# EAGLE design SmartPlug (EAGLE 6.4)
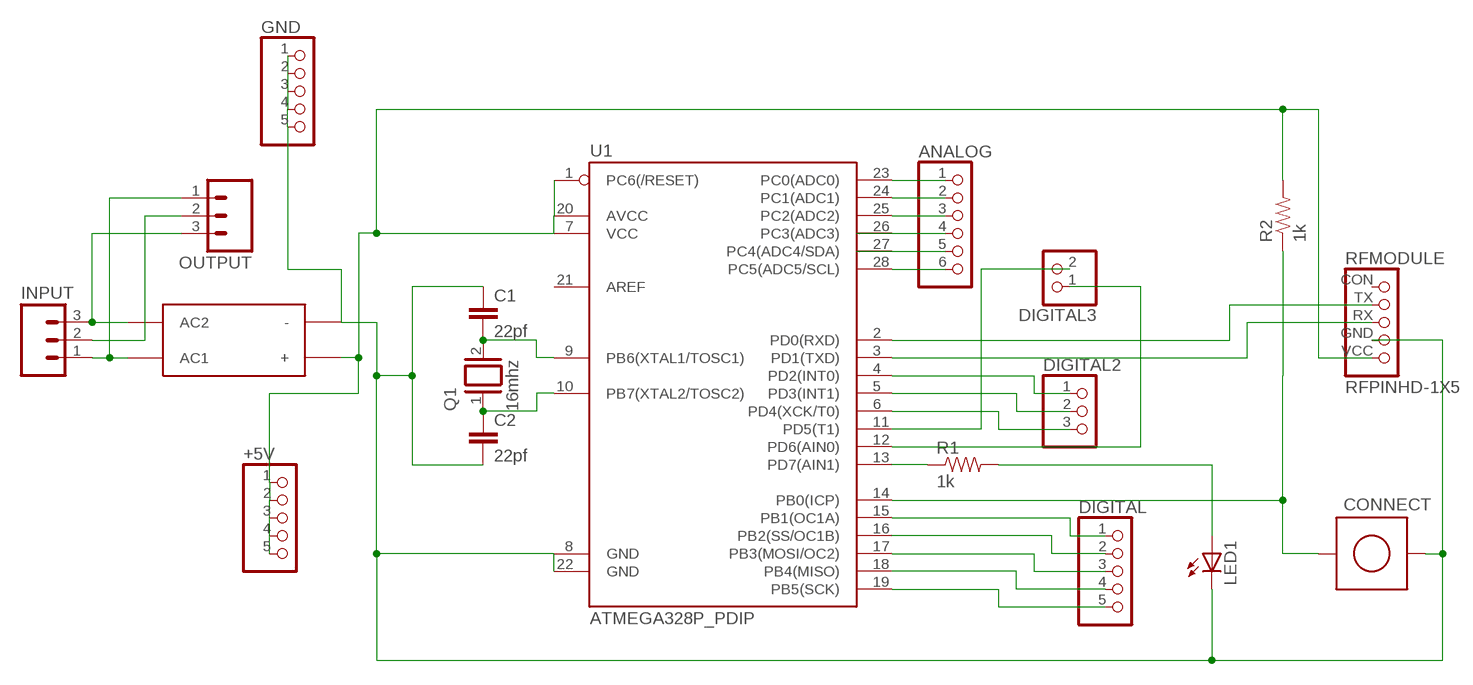
[diagram p0: schematic, sheet 1]

## Parts
+5V  PINHD-1X5  [1X05]
ANALOG  PINHD-1X6  [1X06]
C1  22pf  CAPPTH1  [CAP-PTH-5MM]
C2  22pf  CAPPTH1  [CAP-PTH-5MM]
CONNECT  PUSHBUTTON6MM  [PUSHBUTTON6MM]
DIGITAL  PINHD-1X5  [1X05]
DIGITAL2  PINHD-1X3  [1X03]
DIGITAL3  PINHD-1X2  [1X02]
GND  PINHD-1X5  [1X05]
INPUT  M03-SCREW-5MM  [SCREWTERMINAL-5MM-3]
LED1  LED3MM  [LED3MM]
OUTPUT  M03-SCREW-5MM  [SCREWTERMINAL-5MM-3]
POWERMODULE  POWER_MODULE  [POWER_MODULE]
Q1  16mhz  XTAL/S  [QS]
R1  1k  RESISTORPTH-1/6W  [1/6W-RES]
R2  1k  RESISTORPTH-1/6W  [1/6W-RES]
RFMODULE  RFPINHD-1X5  [1X05]
U1  ATMEGA328P_PDIP  [DIL28-3]

## Nets
N$1: RFMODULE.TX U1.2(PD0(RXD))
N$2: RFMODULE.RX U1.3(PD1(TXD))
N$3: LED1.A R1.2
N$4: +5V.1 +5V.2 +5V.3 +5V.4 +5V.5 POWERMODULE.+ R2.2 RFMODULE.VCC U1.1(PC6(/RESET)) U1.7(VCC) U1.20(AVCC)
N$5: C1.2 Q1.2 U1.9(PB6(XTAL1/TOSC1))
N$6: C2.1 Q1.1 U1.10(PB7(XTAL2/TOSC2))
N$7: CONNECT.P$1 R2.1 U1.14(PB0(ICP))
N$8: ANALOG.1 U1.23(PC0(ADC0))
N$9: ANALOG.5 U1.27(PC4(ADC4/SDA))
N$10: DIGITAL3.2 U1.11(PD5(T1))
N$11: R1.1 U1.13(PD7(AIN1))
N$12: ANALOG.2 U1.24(PC1(ADC1))
N$13: ANALOG.3 U1.25(PC2(ADC2))
N$14: ANALOG.6 U1.28(PC5(ADC5/SCL))
N$15: DIGITAL.1 U1.15(PB1(OC1A))
N$16: DIGITAL.2 U1.16(PB2(SS/OC1B))
N$17: DIGITAL.3 U1.17(PB3(MOSI/OC2))
N$18: DIGITAL.4 U1.18(PB4(MISO))
N$19: DIGITAL.5 U1.19(PB5(SCK))
N$20: INPUT.3 OUTPUT.3 POWERMODULE.AC2
N$21: INPUT.2 OUTPUT.2
N$22: INPUT.1 OUTPUT.1 POWERMODULE.AC1
N$23: DIGITAL2.1 U1.4(PD2(INT0))
N$24: DIGITAL2.2 U1.5(PD3(INT1))
N$25: DIGITAL2.3 U1.6(PD4(XCK/T0))
N$26: DIGITAL3.1 U1.12(PD6(AIN0))
N$27: ANALOG.4 U1.26(PC3(ADC3))
N$28: C1.1 C2.2 CONNECT.P$2 GND.1 GND.2 GND.3 GND.4 GND.5 LED1.K(C) POWERMODULE.- RFMODULE.GND U1.8(GND) U1.22(GND)
Unconnected: RFMODULE.CON U1.21(AREF)

## Library data of the parts
+5V DIGITAL GND = pinhead:PINHD-1X5: PIN HEADER
ANALOG = pinhead:PINHD-1X6: PIN HEADER
C1 C2 = SparkFun-Passives:CAP: Capacitor Standard 0603 ceramic capacitor, and 0.1" leaded capacitor.
CONNECT = jalf:PUSHBUTTON6MM
DIGITAL2 = pinhead:PINHD-1X3: PIN HEADER
DIGITAL3 = pinhead:PINHD-1X2: PIN HEADER
INPUT OUTPUT = SparkFun-Connectors:M03: Header 3 Standard 3-pin 0.1" header. Use with straight break away headers (SKU : PRT-00116), right angle break away headers (PRT-00553), swiss pins (PRT-00743), machine pins (PRT-00117), and female headers (PRT-00115). Molex polarized connector foot print use with SKU : PRT-08232 with associated crimp pins and housings.
LED1 = SparkFun-LED:LED: LEDs Standard schematic elements and footprints for 5mm, 3mm, 1206, and 0603 sized LEDs. 5mm - Spark Fun Electronics SKU : COM-00529 (and others)
POWERMODULE = jalf:POWER_MODULE
Q1 = special:XTAL/S: CRYSTAL
R1 R2 = SparkFun-Passives:RESISTOR: Resistor Basic schematic elements and footprints for 0603, 1206, and PTH resistors.
RFMODULE = jalf:RFPINHD-1X5: PIN HEADER
U1 = SparkFun-DigitalIC:ATMEGA328P_PDIP: uC used in the Arduino 32kb flash, 1k EEPROM, 2k SRAM This is the through-hole version of this chip.

## Board
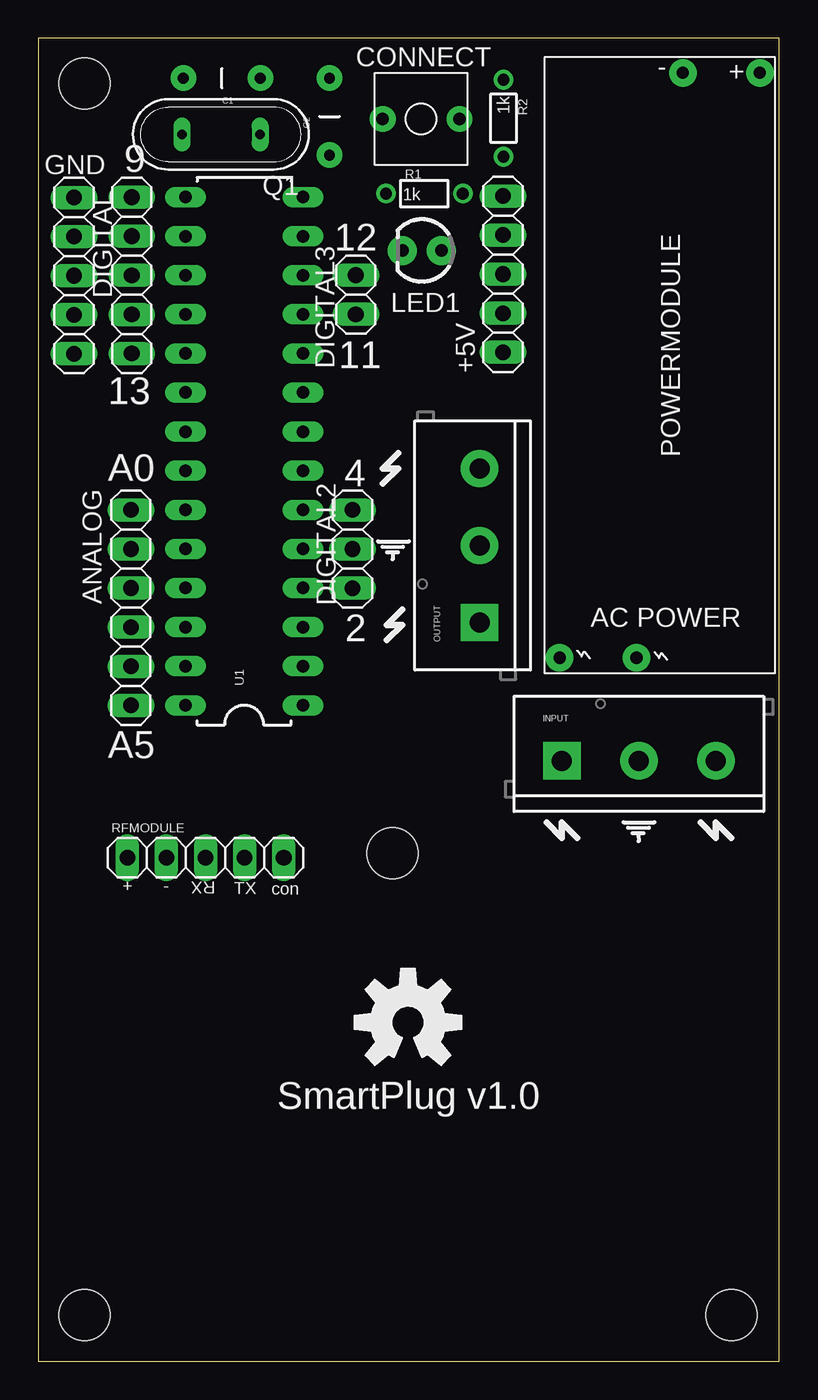
[diagram p1: board, top side]
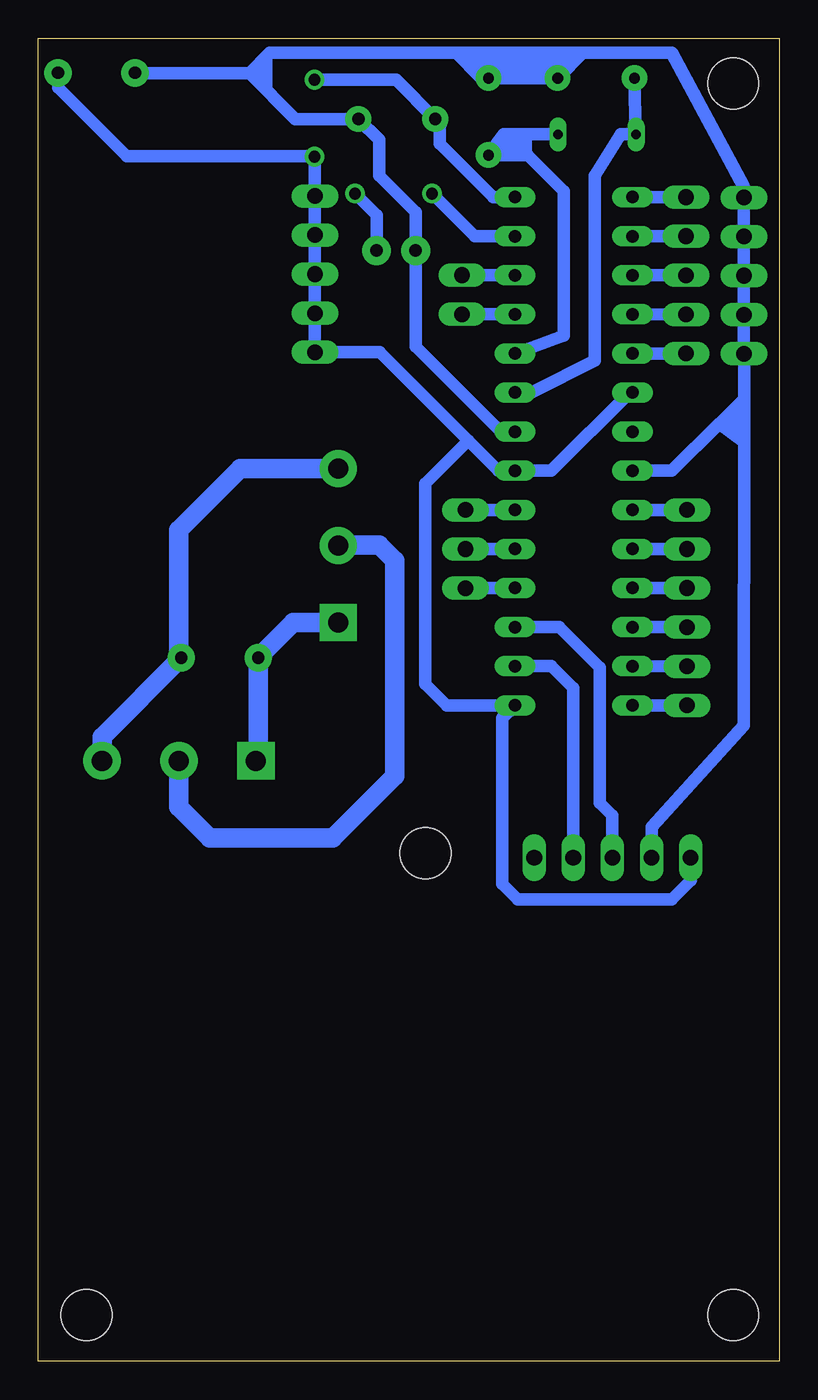
[diagram p2: board, bottom side, seen from below]

Size 48.12 x 85.93 mm. Coordinates in mm from the lower left corner, seen from the top.
Outline: 0,0 48.12,0 48.12,85.93 0,85.93 0,0
Copper layers (1*16): Top 0.035mm / dielectric 1.5mm / Bottom 0.035mm
Design rules "default": minimum track width 10mil, minimum drill 24mil, track to track 8mil, track to pad 8mil, pad to pad 8mil, via to via 8mil, smd to smd 8mil, copper to edge 40mil, drill to drill 8mil, minimum pad ring 10mil, minimum via ring 8mil, stop-mask expansion 4mil, vias tented up to drill 0mil, thermal gap 10mil

### Footprints (pad centres in the part's own frame; a part is rotated, then mirrored left to right if it is on the bottom)
1X05 = drill 1.016 long: 1 -5.08,0; 2 -2.54,0; 3 0,0; 4 2.54,0; 5 5.08,0
1X06 = drill 1.016 long: 1 -6.35,0; 2 -3.81,0; 3 -1.27,0; 4 1.27,0; 5 3.81,0; 6 6.35,0
CAP-PTH-5MM = drill 0.7 pad 1.651: 1 -2.5,0; 2 2.5,0
PUSHBUTTON6MM = drill 0.8 pad 1.676: P$1 -2.5,0; P$2 2.5,0
1X03 = drill 1.016 long: 1 -2.54,0; 2 0,0; 3 2.54,0
1X02 = drill 1.016 long: 1 -1.27,0; 2 1.27,0
SCREWTERMINAL-5MM-3 = drill 1.3 pad 2.413 square: 1 0,0 | drill 1.3 pad 2.413: 2 5,0; 3 10,0
LED3MM = drill 0.813 pad 1.88: A -1.27,0; K 1.27,0
POWER_MODULE = drill 0.8 pad 1.778: + 6,18; - 1,18; AC1 -7,-20; AC2 -2,-20
QS = drill 0.61 long: 1 -2.54,0; 2 2.54,0
1/6W-RES = drill 0.762: 1 -2.5,0; 2 2.5,0
1X05' = drill 1.016 long: CON -5.08,0; GND 2.54,0; RX 0,0; TX -2.54,0; VCC 5.08,0
DIL28-3 = drill 0.813 long: 1 -16.51,-3.81; 2 -13.97,-3.81; 3 -11.43,-3.81; 4 -8.89,-3.81; 5 -6.35,-3.81; 6 -3.81,-3.81; 7 -1.27,-3.81; 8 1.27,-3.81; 9 3.81,-3.81; 10 6.35,-3.81; 11 8.89,-3.81; 12 11.43,-3.81; 13 13.97,-3.81; 14 16.51,-3.81; 15 16.51,3.81; 16 13.97,3.81; 17 11.43,3.81; 18 8.89,3.81; 19 6.35,3.81; 20 3.81,3.81; 21 1.27,3.81; 22 -1.27,3.81; 23 -3.81,3.81; 24 -6.35,3.81; 25 -8.89,3.81; 26 -11.43,3.81; 27 -13.97,3.81; 28 -16.51,3.81
STAND-OFF = hole 3.302: 0,0

### Placement (x,y rotation side)
+5V  30.17,70.62 90 top
ANALOG  6,48.95 270 top
C1  11.91,83.35 180 top
C2  18.9,80.85 90 top
CONNECT  24.85,80.7 0 top
DIGITAL  6.06,70.54 270 top
DIGITAL2  20.4,52.76 90 top
DIGITAL3  20.61,69.28 270 top
GND  2.3,70.52 270 top
INPUT  34,39 0 top
LED1  24.9,72.15 180 top
OUTPUT  28.65,47.99 90 top
POWERMODULE  40.85,65.7 0 top
Q1  11.85,79.7 180 top
R1  25.06,75.85 0 top
R2  30.2,80.75 270 top
RFMODULE  RFPINHD-1X5  [1X05']  10.85,32.7 180 top
U1  13.36,59.12 90 top
U$1  [OSHW-LOGO-L]  24,22 0 top
U$2  [STAND-OFF]  3,83 0 top
U$3  [STAND-OFF]  23,33 0 top
U$4  [STAND-OFF]  3,3 0 top
U$5  [STAND-OFF]  45,3 0 top

### Tracks (layer width: path | path; a pad name or v marks a point on that pad's centre or on a via)
N$1
  Bottom 0.813: U1.2 14.83,45.15 13.4,43.72 13.4,32.71 RFMODULE.TX
N$2
  Bottom 0.813: RFMODULE.RX 10.85,35.44 11.68,36.27 11.68,45.07 14.29,47.68 U1.3
N$3
  Bottom 0.813: LED1.A 26.17,74.46 R1.2
N$4
  Bottom 0.813: POWERMODULE.+ 46.85,82.72 42.4,78.27 30.22,78.27 R2.2 30.17,78.22 +5V.5 +5V.4 +5V.3 +5V.2 +5V.1 25.96,65.54 20.21,59.79 | U1.20 9.73,62.92 14.81,57.84 U1.7 18.26,57.84 20.21,59.79 | RFMODULE.VCC 5.77,31.23 7,30 17,30 18,31 18,41 18,41.77 U1.1 21.61,42.6 23,44 23,57 20.21,59.79
N$5
  Bottom 0.813: C1.2 9.35,79.74 Q1.2 10.3,79.7 12,77 12,65 16,63 17.09,63 U1.9
N$6
  Bottom 0.813: Q1.1 17.9,79.7 C2.1 16.35,78.35 14,76 14,66.63 U1.10
N$7
  Bottom 0.813: CONNECT.P$1 22,80.35 | R2.1 24.9,83.25 CONNECT.P$1 | U1.14 18.58,75.62 22.06,79.1 22.06,80.41 CONNECT.P$1
N$8
  Bottom 0.813: ANALOG.1 U1.23
N$9
  Bottom 0.813: U1.27 ANALOG.5
N$10
  Bottom 0.813: DIGITAL3.2 U1.11
N$11
  Bottom 0.813: U1.13 19.8,73.08 R1.1
N$12
  Bottom 0.813: U1.24 ANALOG.2
N$13
  Bottom 0.813: U1.25 ANALOG.3
N$14
  Bottom 0.813: U1.28 ANALOG.6
N$15
  Bottom 0.813: DIGITAL.1 U1.15
N$16
  Bottom 0.813: DIGITAL.2 U1.16
N$17
  Bottom 0.813: DIGITAL.3 U1.17
N$18
  Bottom 0.813: DIGITAL.4 U1.18
N$19
  Bottom 0.813: DIGITAL.5 U1.19
N$20
  Bottom 1.27: INPUT.3 44,40.55 POWERMODULE.AC2 39,45.85 39,54 35.01,57.99 OUTPUT.3
N$21
  Bottom 1.27: INPUT.2 39,36 37,34 29,34 25,38 25,51 25,52 26,53 28.64,53 OUTPUT.2
N$22
  Bottom 1.27: INPUT.1 33.85,39.15 POWERMODULE.AC1 31.56,47.99 OUTPUT.1
N$23
  Bottom 0.813: U1.4 DIGITAL2.1
N$24
  Bottom 0.813: DIGITAL2.2 17.18,52.76 U1.5
N$25
  Bottom 0.813: U1.6 DIGITAL2.3
N$26
  Bottom 0.813: DIGITAL3.1 U1.12
N$27
  Bottom 0.813: U1.26 ANALOG.4
N$28
  Bottom 0.813: GND.1 GND.2 GND.3 GND.4 GND.5 | C2.2 C1.1 12.76,85 7,85 2.3,76.3 GND.5 | C2.2 | 34.42,83.69 31.43,80.7 CONNECT.P$2 26,79.35 26,77 23.63,74.63 LED1.K 23.62,65.92 18.09,60.38 U1.8 | 34.42,83.69 41.84,83.69 POWERMODULE.- | C2.2 19.35,83.35 21,85 33.11,85 34.42,83.69 | U1.22 6.98,57.84 3.91,60.91 | 3.91,60.91 2.29,62.53 GND.5 | RFMODULE.GND 8.31,34.69 2.31,41.29 2.29,59.69 3.91,60.91
(copper drawn outside any net)
  shapes: Bottom area x6

### Text on the board
tNames: 9 | 12 | 11 | 13 | A0 | 4 | 2 | A5 | SmartPlug v1.0